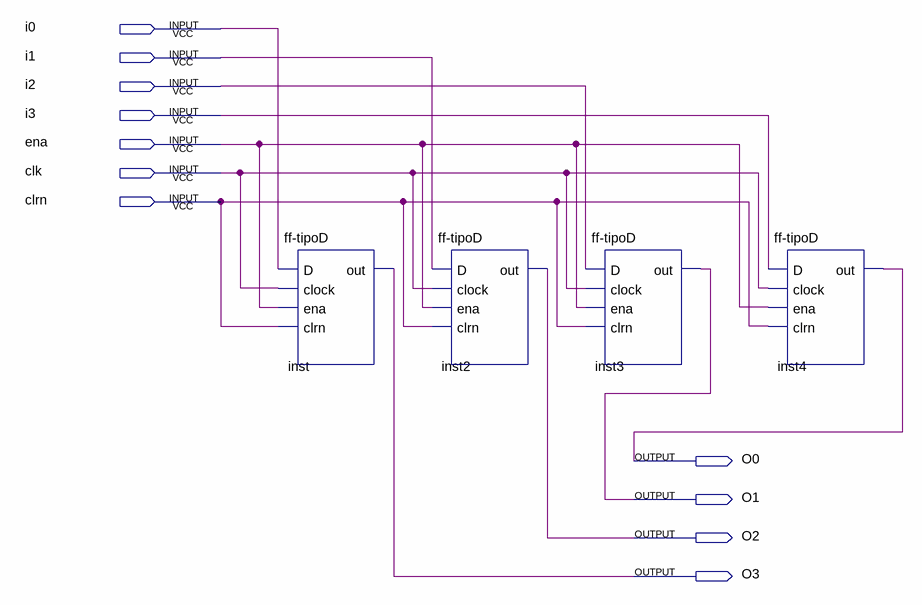
[diagram p0: schematic sheet]
// Quartus schematic registrador.bdf as structural Verilog: 4 symbols, 11 pins
module registrador (
  input  i0,
  input  i1,
  input  i2,
  input  i3,
  input  ena,
  input  clk,
  input  clrn,
  output O0,
  output O1,
  output O2,
  output O3
);

  \ff-tipoD  inst (.D(i0), .clock(clk), .ena(ena), .clrn(clrn), .out(O3));
  \ff-tipoD  inst2 (.D(i1), .clock(clk), .ena(ena), .clrn(clrn), .out(O2));
  \ff-tipoD  inst3 (.D(i2), .clock(clk), .ena(ena), .clrn(clrn), .out(O1));
  \ff-tipoD  inst4 (.D(i3), .clock(clk), .ena(ena), .clrn(clrn), .out(O0));
endmodule
